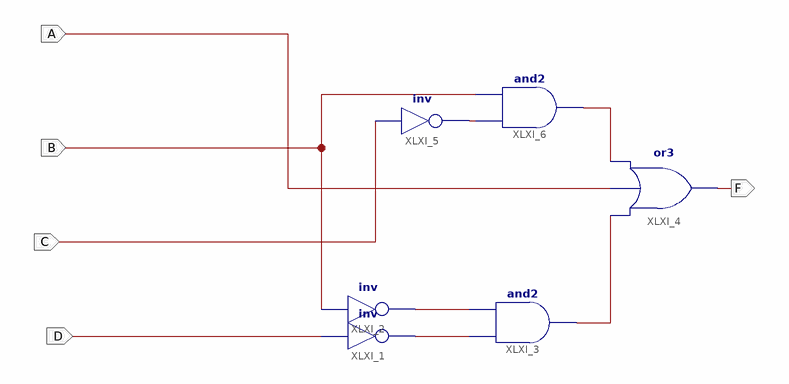
[diagram p0: schematic sheet 1]
// Xilinx ISE schematic moduleLab03.sch (spartan6) as structural Verilog: 6 symbols, 5 ports
module moduleLab03 (
  input  A,
  input  B,
  input  C,
  input  D,
  output F
);

  wire XLXN_7, XLXN_8, XLXN_9, XLXN_11, XLXN_18;

  not XLXI_1 (XLXN_7, D);
  not XLXI_2 (XLXN_8, B);
  and XLXI_3 (XLXN_9, XLXN_7, XLXN_8);
  or XLXI_4 (F, XLXN_9, A, XLXN_18);
  not XLXI_5 (XLXN_11, C);
  and XLXI_6 (XLXN_18, XLXN_11, B);
endmodule
